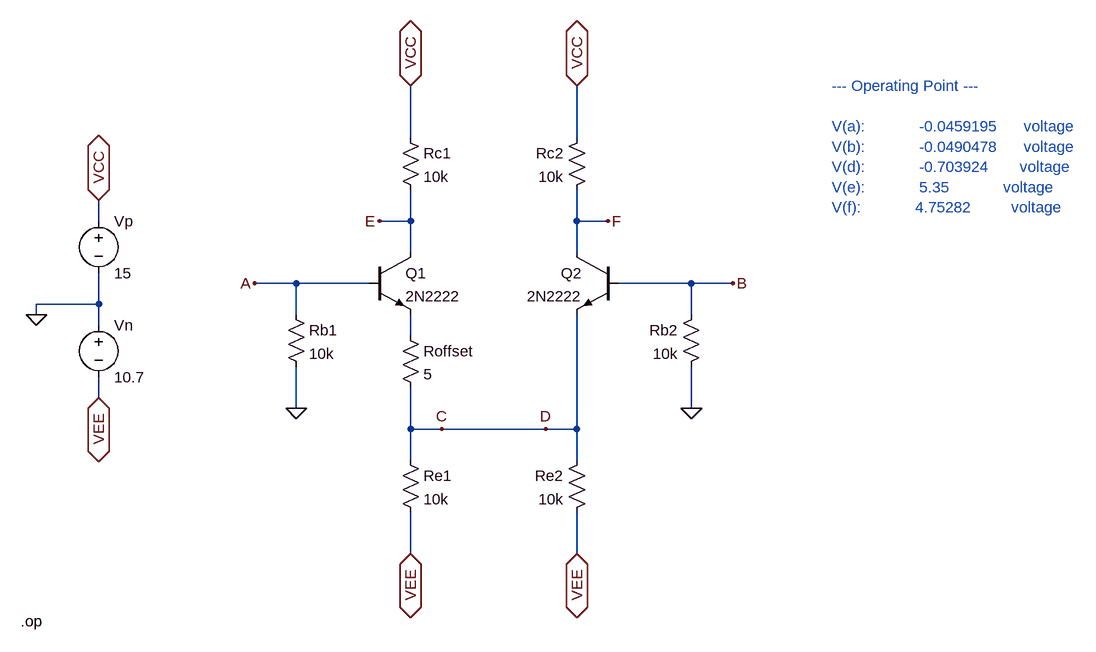
[diagram p0: schematic e1_1_b.asc]
e1_1_b.asc, the LTspice schematic file:
Version 4
SHEET 1 1744 824
WIRE 528 16 528 -64
WIRE 784 16 784 -64
WIRE 48 144 48 112
WIRE 528 144 528 96
WIRE 528 144 480 144
WIRE 784 144 784 96
WIRE 832 144 784 144
WIRE 528 192 528 144
WIRE 784 192 784 144
WIRE 352 240 288 240
WIRE 464 240 352 240
WIRE 960 240 848 240
WIRE 1024 240 960 240
WIRE 48 272 48 224
WIRE 48 272 -48 272
WIRE -48 288 -48 272
WIRE 352 288 352 240
WIRE 960 288 960 240
WIRE 48 304 48 272
WIRE 528 320 528 288
WIRE 48 416 48 384
WIRE 352 432 352 368
WIRE 960 432 960 368
WIRE 528 464 528 400
WIRE 576 464 528 464
WIRE 736 464 576 464
WIRE 784 464 784 288
WIRE 784 464 736 464
WIRE 528 512 528 464
WIRE 784 512 784 464
WIRE 528 656 528 592
WIRE 784 656 784 592
FLAG -48 288 0
FLAG 48 112 VCC
IOPIN 48 112 BiDir
FLAG 48 416 VEE
IOPIN 48 416 BiDir
FLAG 352 432 0
FLAG 528 -64 VCC
IOPIN 528 -64 BiDir
FLAG 480 144 E
FLAG 288 240 A
FLAG 528 656 VEE
IOPIN 528 656 BiDir
FLAG 576 464 C
FLAG 960 432 0
FLAG 784 -64 VCC
IOPIN 784 -64 BiDir
FLAG 832 144 F
FLAG 1024 240 B
FLAG 784 656 VEE
IOPIN 784 656 BiDir
FLAG 736 464 D
SYMBOL voltage 48 128 R0
SYMATTR InstName Vp
SYMATTR Value 15
SYMBOL voltage 48 288 R0
SYMATTR InstName Vn
SYMATTR Value 10.7
SYMBOL npn 464 192 R0
SYMATTR InstName Q1
SYMATTR Value 2N2222
SYMBOL res 512 304 R0
SYMATTR InstName Roffset
SYMATTR Value 5
SYMBOL res 512 0 R0
SYMATTR InstName Rc1
SYMATTR Value 10k
SYMBOL res 336 272 R0
SYMATTR InstName Rb1
SYMATTR Value 10k
SYMBOL res 512 496 R0
SYMATTR InstName Re1
SYMATTR Value 10k
SYMBOL npn 848 192 M0
SYMATTR InstName Q2
SYMATTR Value 2N2222
SYMBOL res 800 0 M0
SYMATTR InstName Rc2
SYMATTR Value 10k
SYMBOL res 976 272 M0
SYMATTR InstName Rb2
SYMATTR Value 10k
SYMBOL res 800 496 M0
SYMATTR InstName Re2
SYMATTR Value 10k
TEXT -72 760 Left 2 !.op
TEXT 1176 -64 Left 2 ;--- Operating Point ---\n \nV(a):            -0.0459195      voltage\nV(b):            -0.0490478      voltage\nV(d):            -0.703924       voltage\nV(e):            5.35            voltage\nV(f):            4.75282         voltage

The netlist it stands for:
* e1_1_b.asc
Vp VCC 0 15
Vn 0 VEE 10.7
Q1 E A N001 0 2N2222
Roffset N001 D 5
Rc1 VCC E 10k
Rb1 A 0 10k
Re1 D VEE 10k
Q2 F B D 0 2N2222
Rc2 VCC F 10k
Rb2 B 0 10k
Re2 D VEE 10k
.model NPN NPN
.model PNP PNP
.lib standard.bjt
.op
* --- Operating Point ---
* V(a):            -0.0459195      voltage
* V(b):            -0.0490478      voltage
* V(d):            -0.703924       voltage
* V(e):            5.35            voltage
* V(f):            4.75282         voltage
.backanno
.end